# Altium schematic sheet Audio_testboard.SchDoc (part 1 of 2)
size A0; SheetNumber: 1; SheetTotal: 2
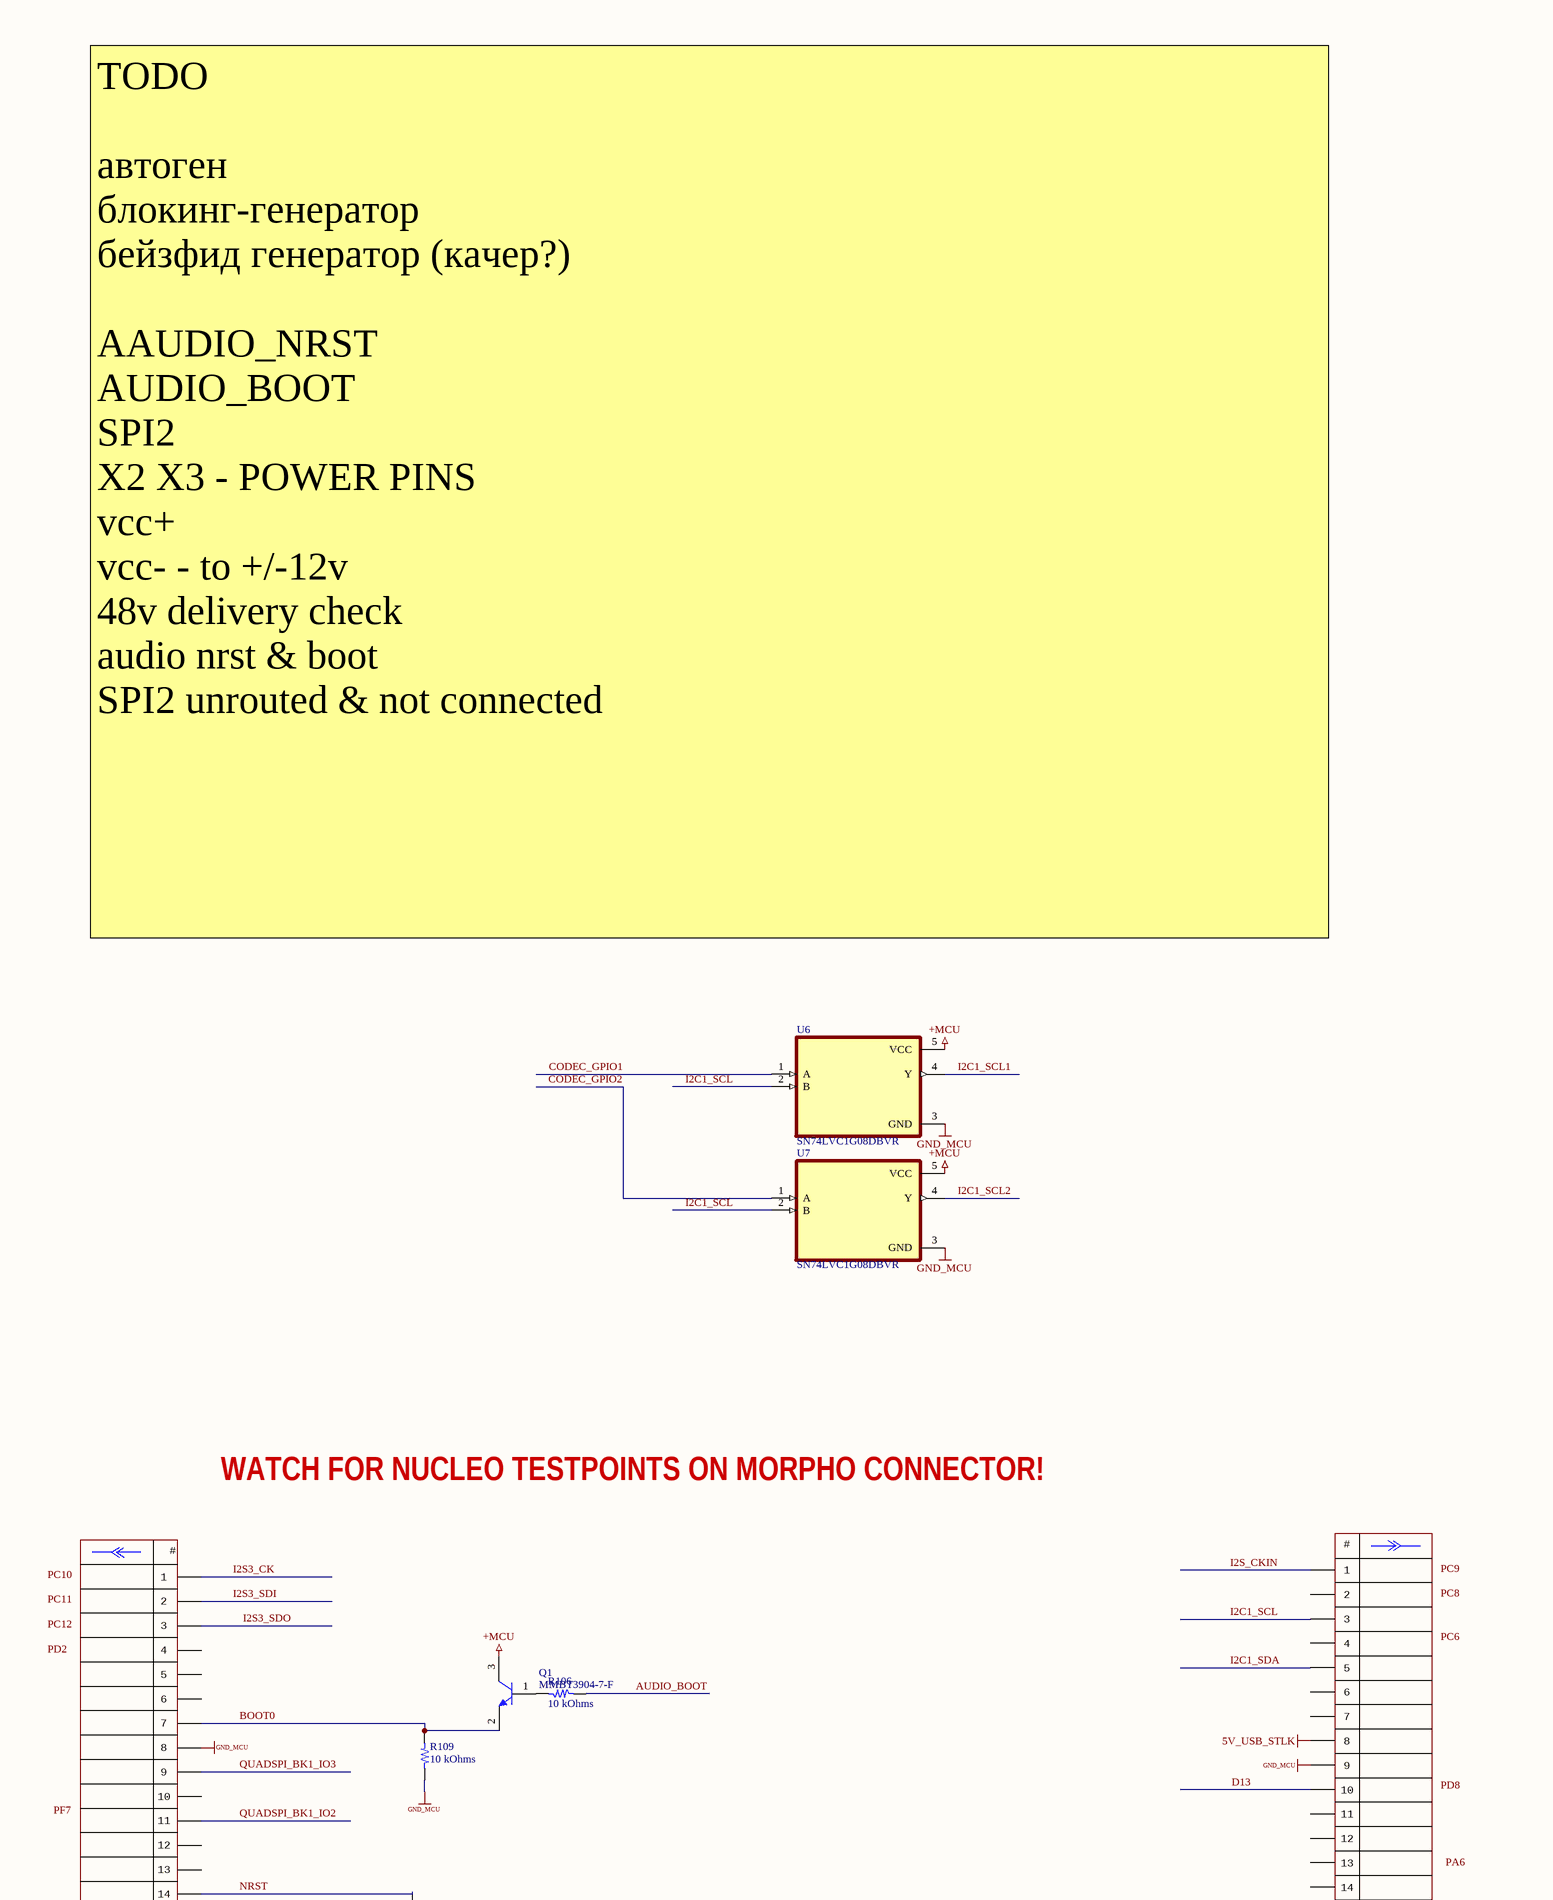
[diagram p0: Audio_testboard.SchDoc, top left]
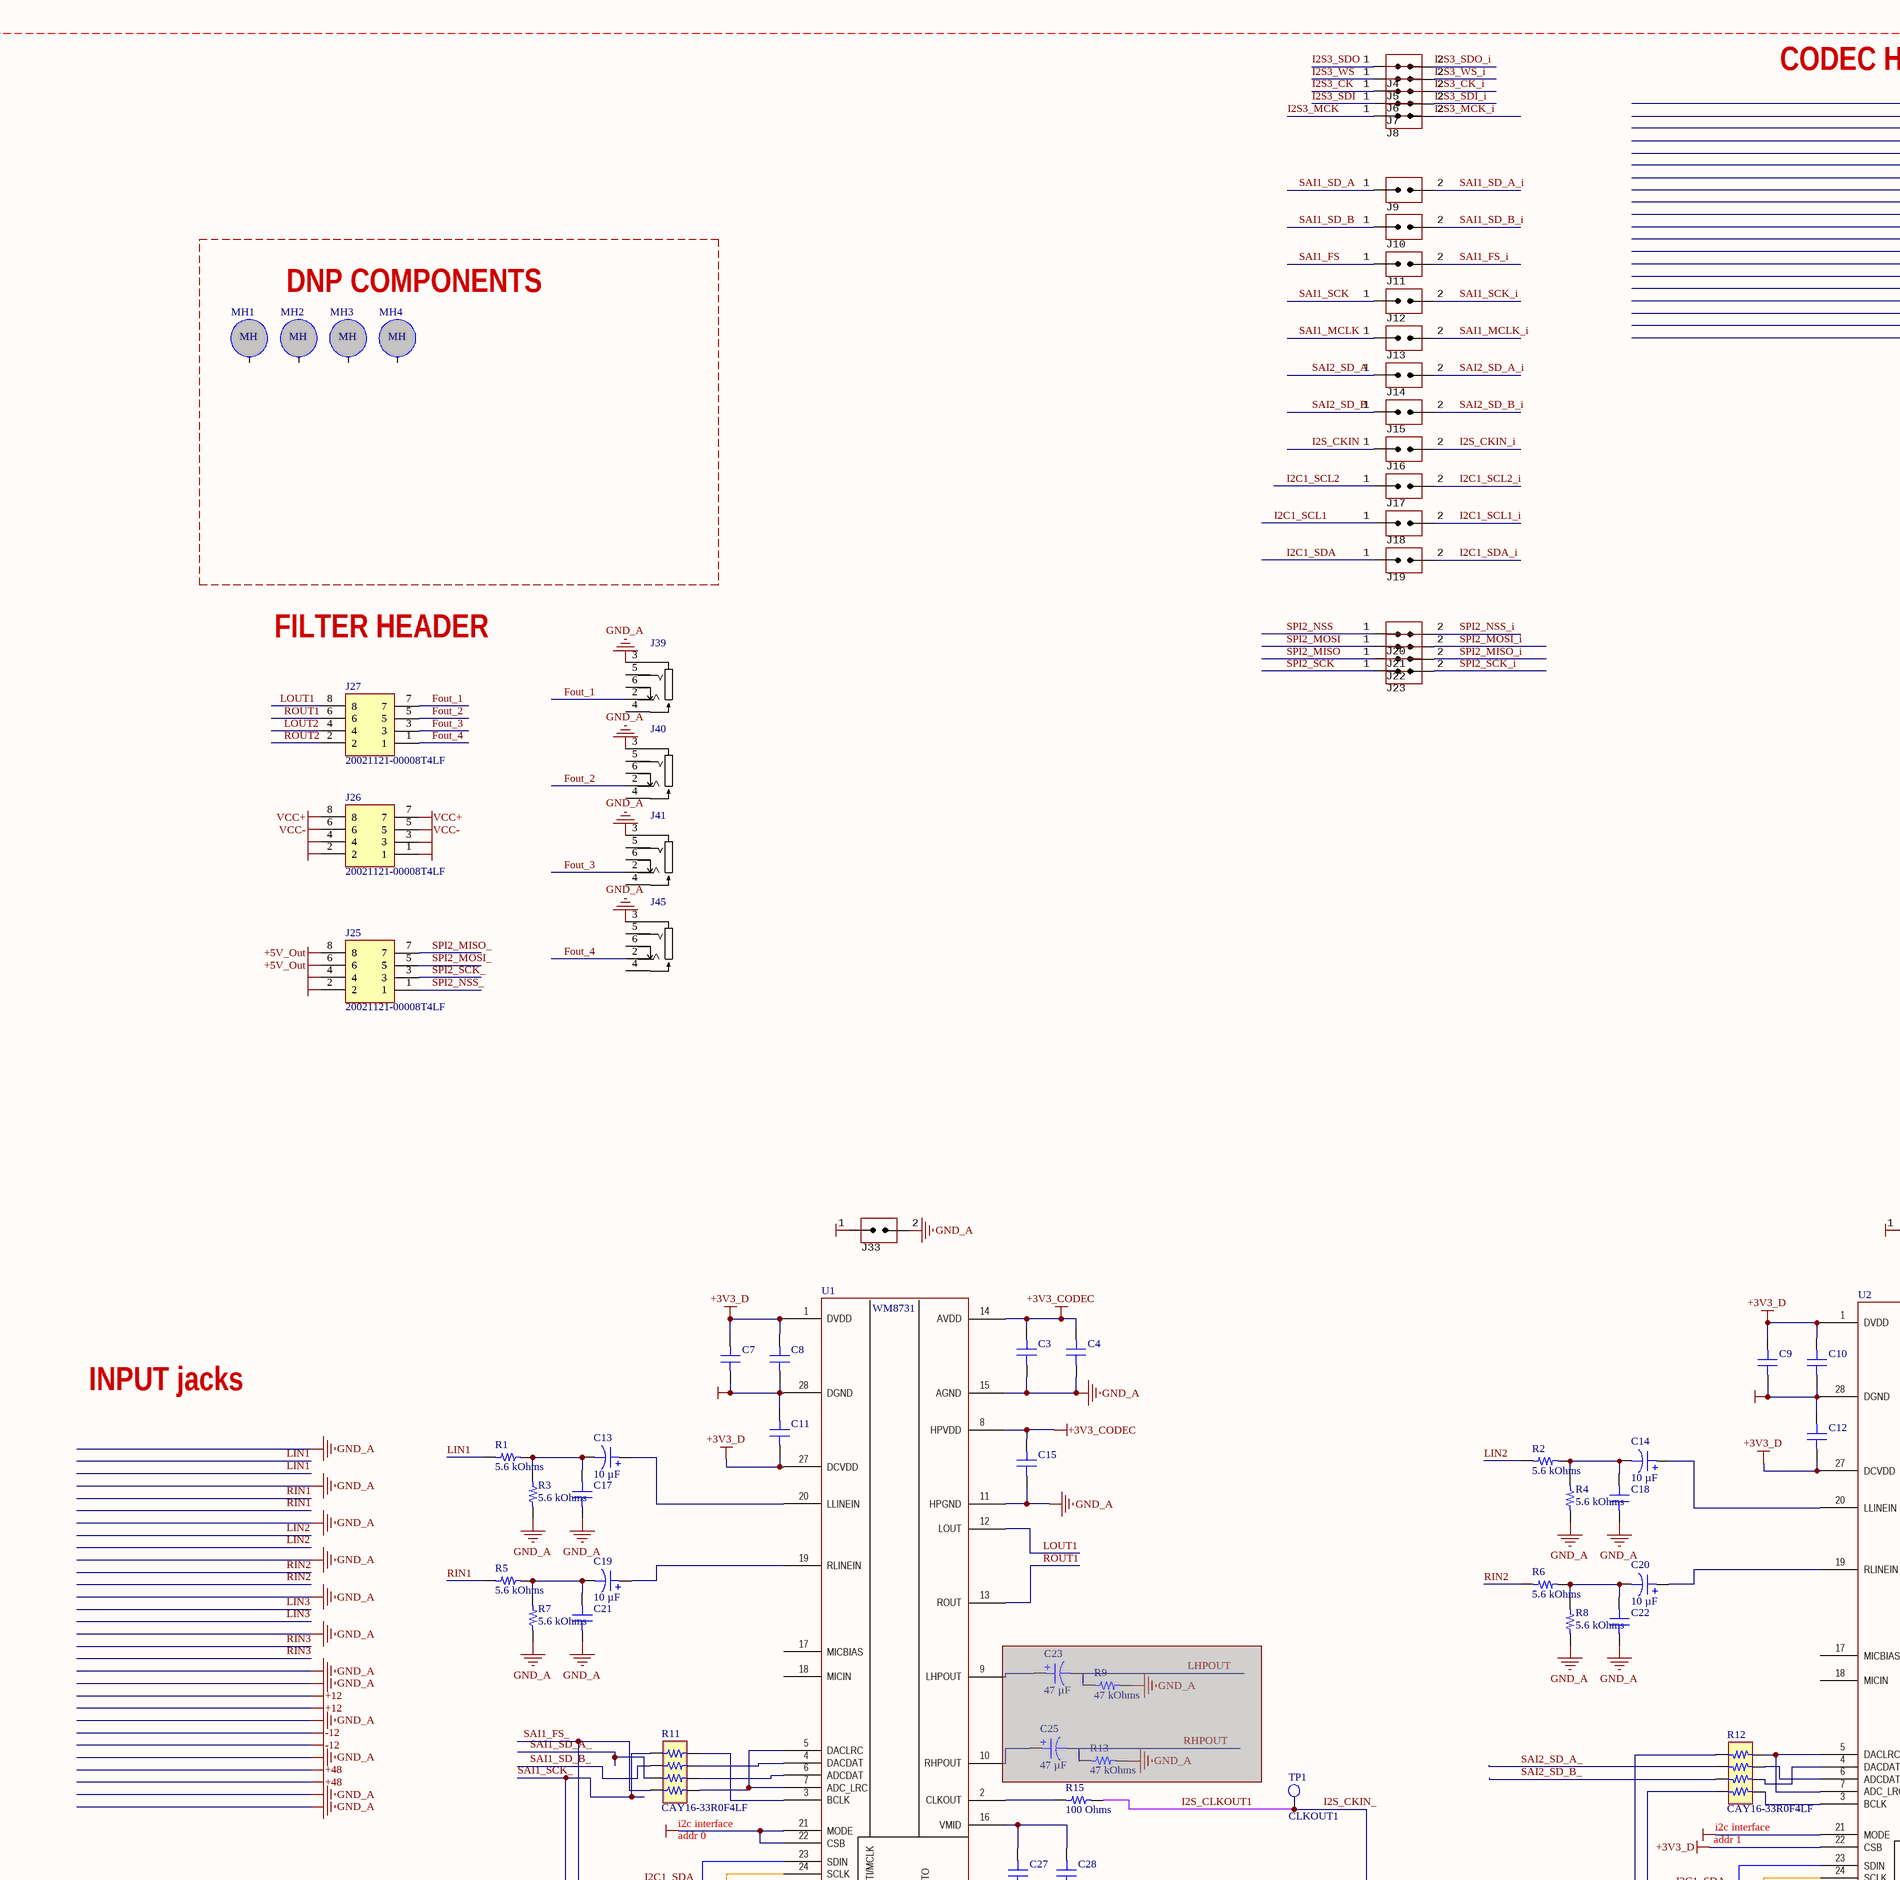
[diagram p1: Audio_testboard.SchDoc, top middle]
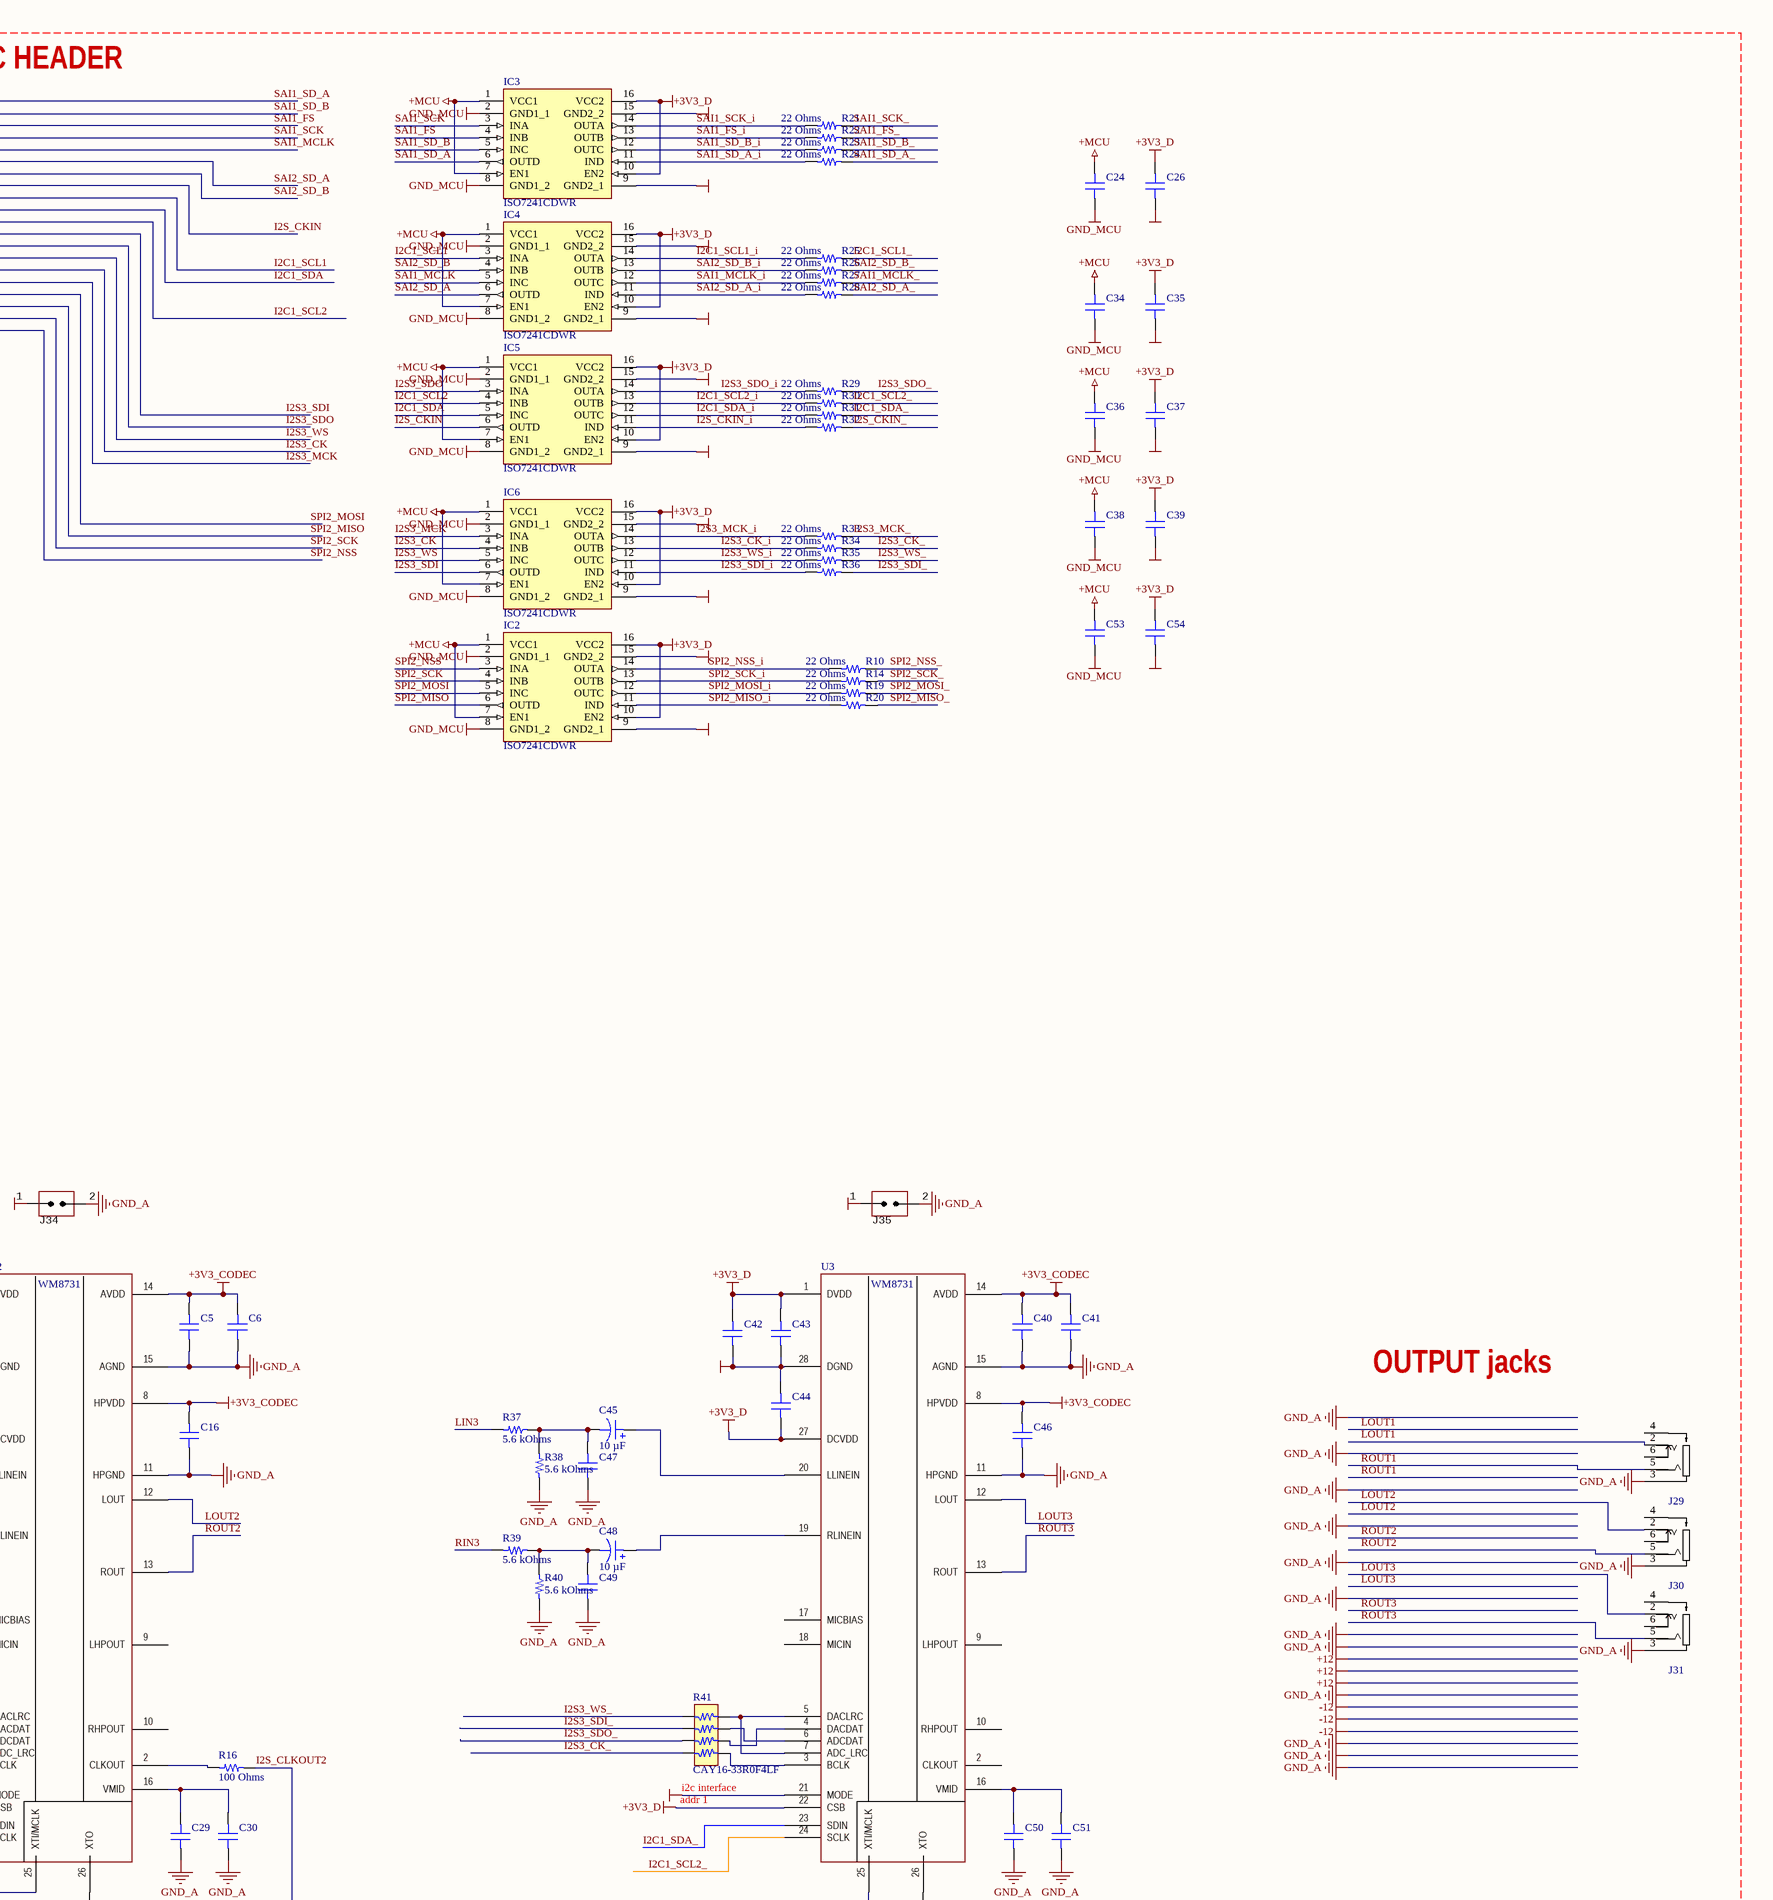
[diagram p2: Audio_testboard.SchDoc, top right]
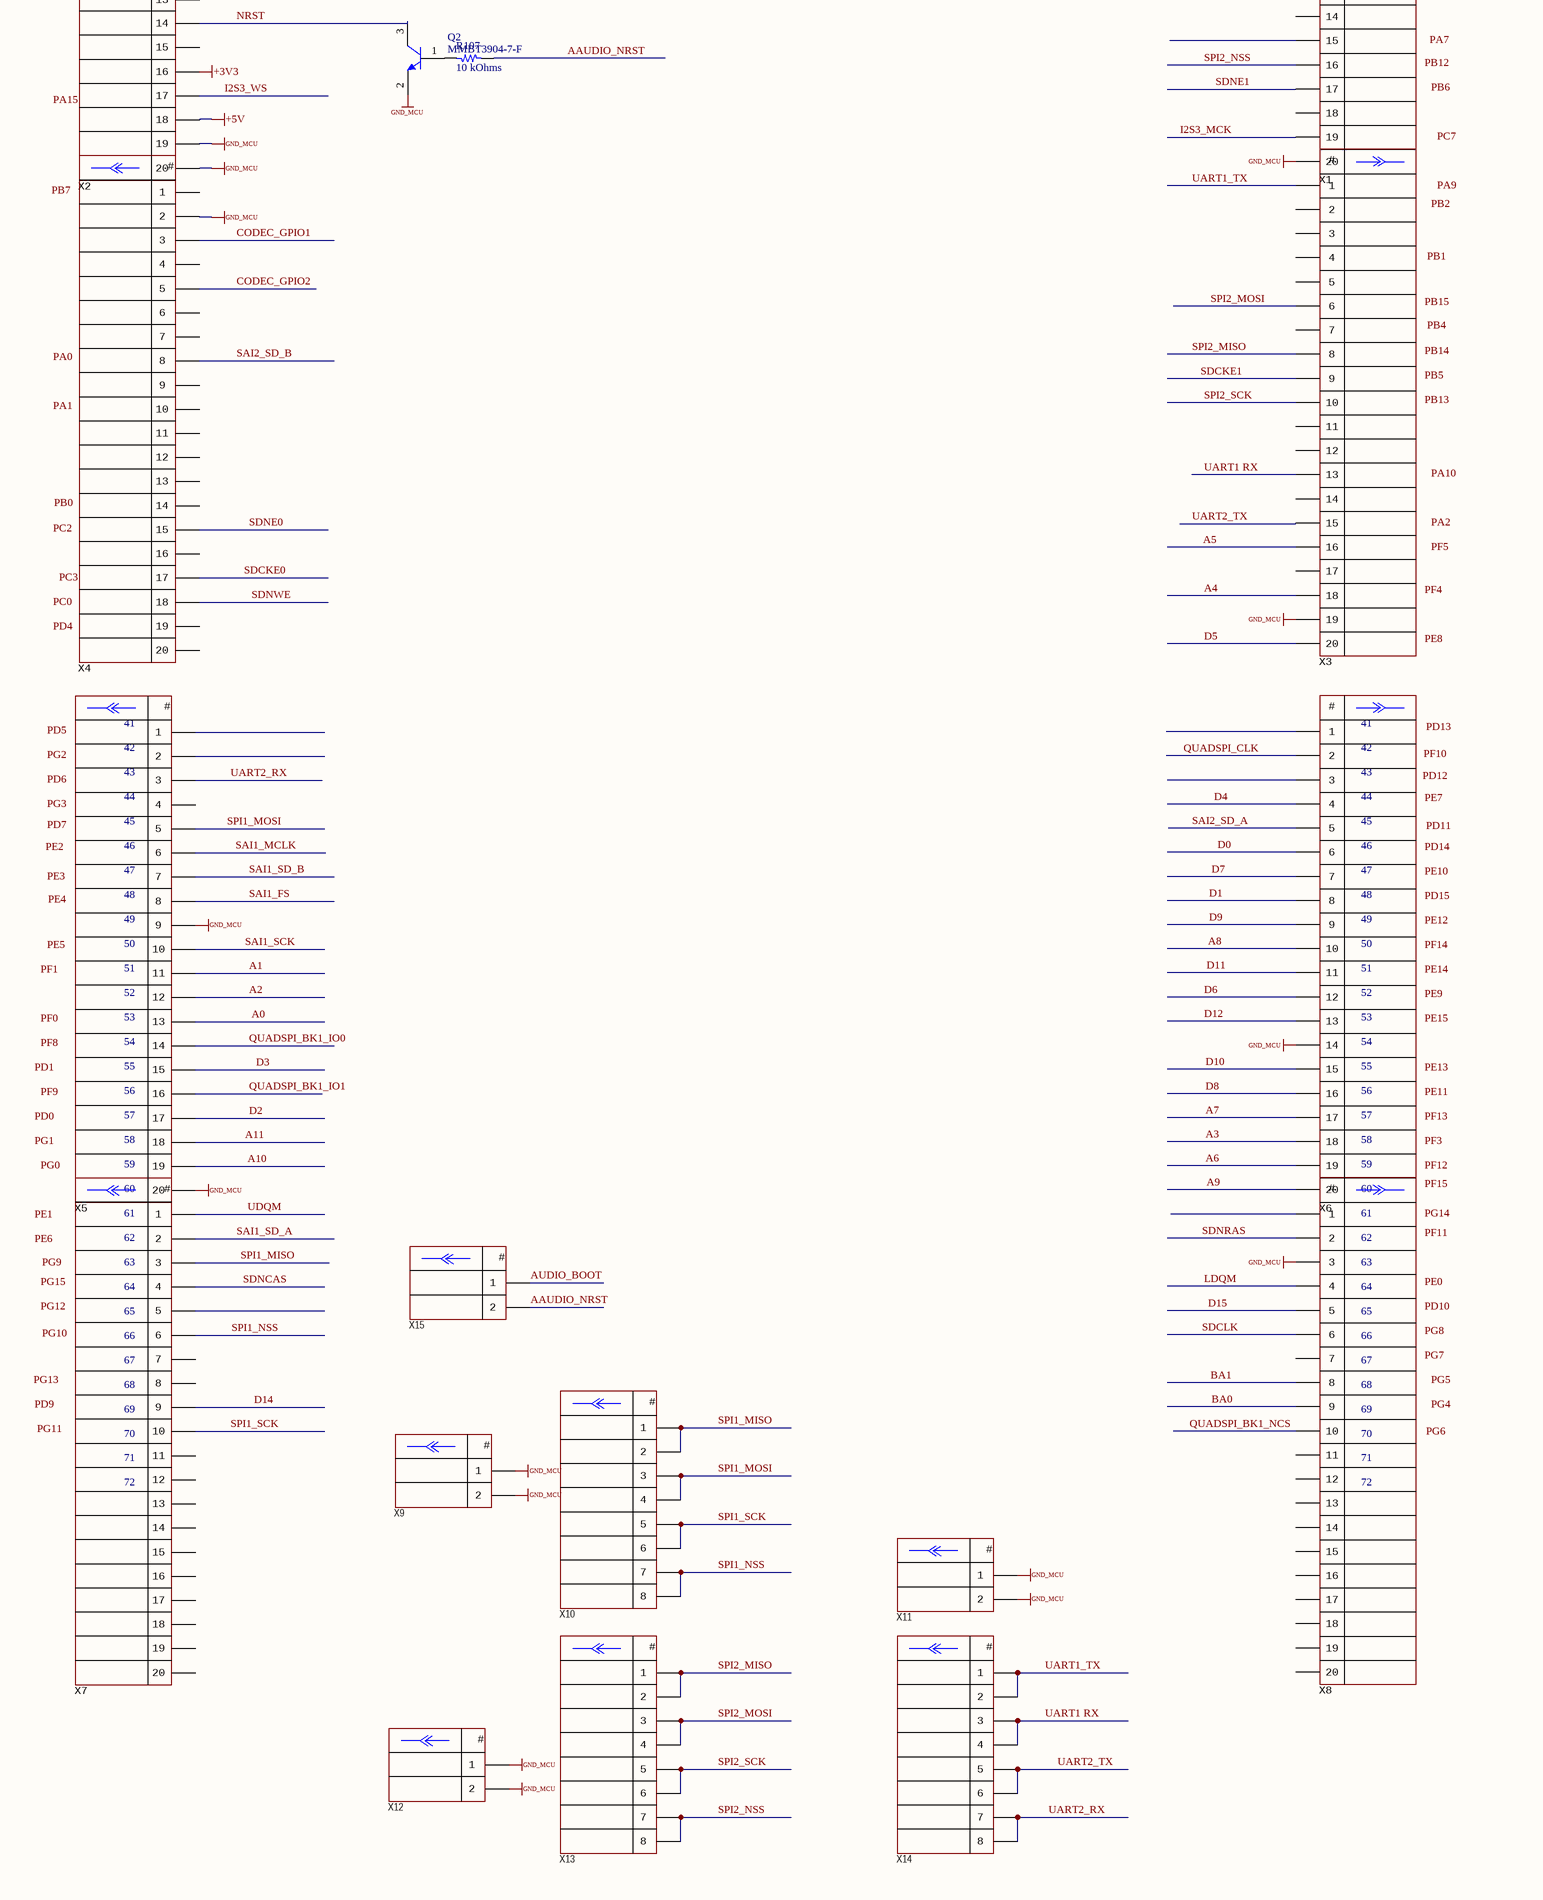
[diagram p3: Audio_testboard.SchDoc, bottom left]
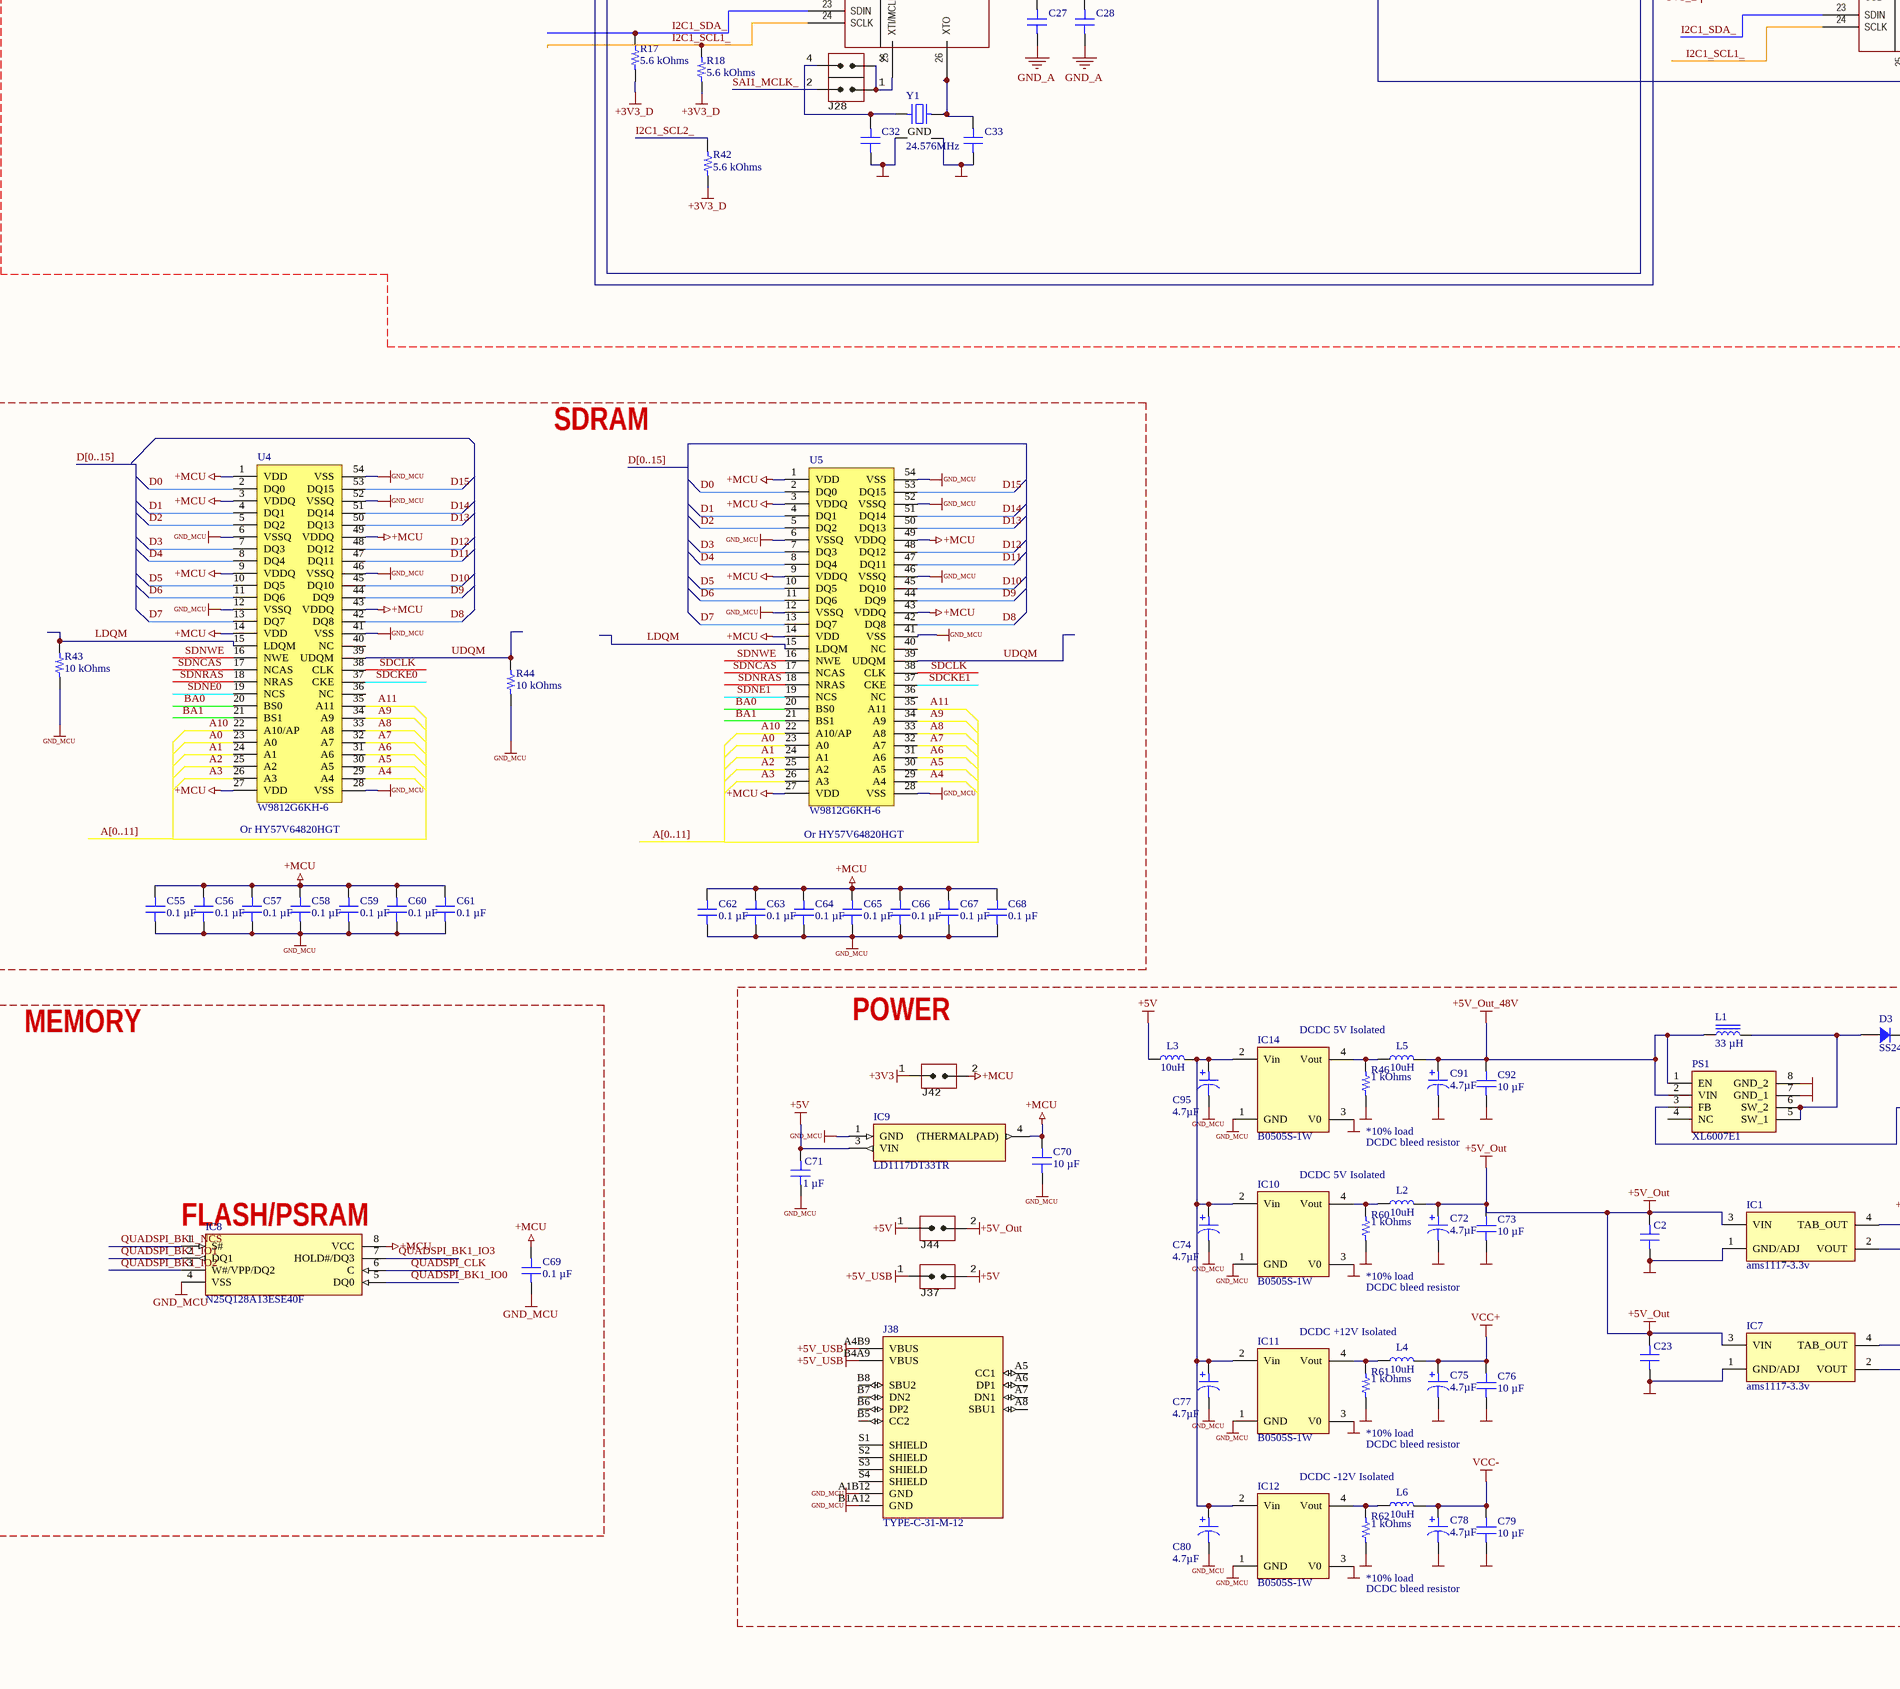
[diagram p4: Audio_testboard.SchDoc, bottom middle]
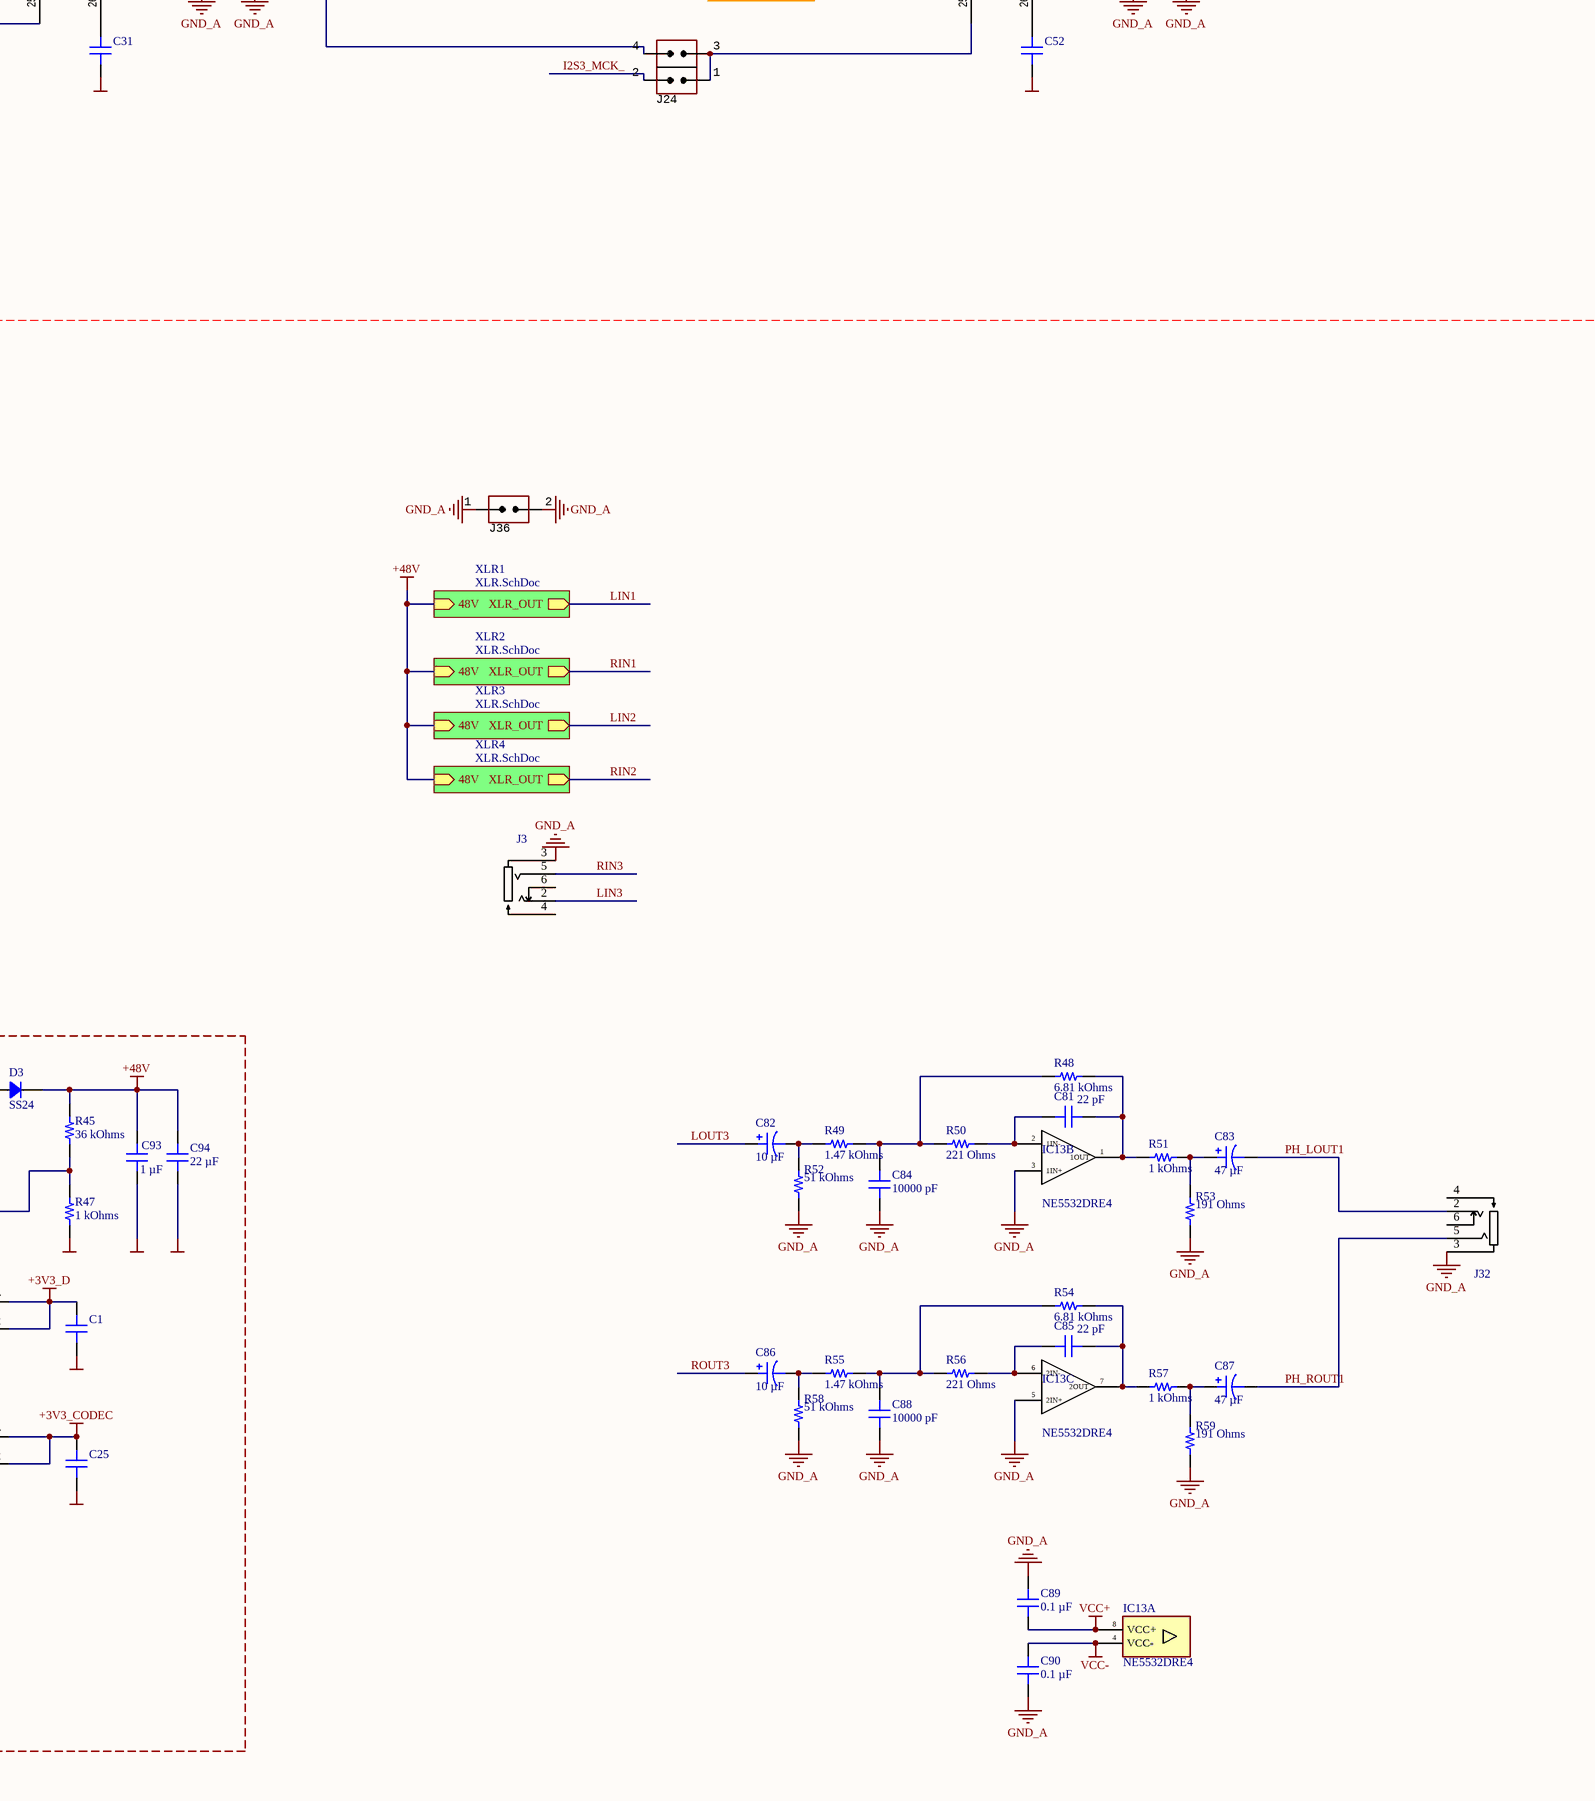
[diagram p5: Audio_testboard.SchDoc, bottom right]

## Parts
(Parts that share a designator on the sheet are numbered #1, #2 ... from top to bottom, then left to right.)
C1  10 µF  [CAP 0805_2012]  (value not drawn)
C2  1 µF  [CAP 0805_2012]  (value not drawn)
C3  0.1 µF  [CAP 0402_1005]  (value not drawn)
C4  10 µF  [CAP 0805_2012]  (value not drawn)
C5  0.1 µF  [CAP 0402_1005]  (value not drawn)
C6  10 µF  [CAP 0805_2012]  (value not drawn)
C7  10 µF  [CAP 0805_2012]  (value not drawn)
C8  0.1 µF  [CAP 0402_1005]  (value not drawn)
C9  10 µF  [CAP 0805_2012]  (value not drawn)
C10  0.1 µF  [CAP 0402_1005]  (value not drawn)
C11  0.1 µF  [CAP 0402_1005]  (value not drawn)
C12  0.1 µF  [CAP 0402_1005]  (value not drawn)
C13  10 µF  [CAP POL 1206_3216]
C14  10 µF  [CAP POL 1206_3216]
C15  0.1 µF  [CAP 0402_1005]  (value not drawn)
C16  0.1 µF  [CAP 0402_1005]  (value not drawn)
C17  220 pF  [CAP 0603_1608]  (value not drawn)
C18  220 pF  [CAP 0603_1608]  (value not drawn)
C19  10 µF  [CAP POL 1206_3216]
C20  10 µF  [CAP POL 1206_3216]
C21  220 pF  [CAP 0603_1608]  (value not drawn)
C22  220 pF  [CAP 0603_1608]  (value not drawn)
C23#1  47 µF  [CAP POL 2917_7343]  (masked out: inside a compile mask, not in the netlist)
C23#2  1 µF  [CAP 0805_2012]  (value not drawn)
C24  0.1µF  [CAP 0603_1608]  (value not drawn)
C25#1  47 µF  [CAP POL 2917_7343]  (masked out: inside a compile mask, not in the netlist)
C25#2  10 µF  [CAP 0805_2012]  (value not drawn)
C26  0.1µF  [CAP 0603_1608]  (value not drawn)
C27  0.1 µF  [CAP 0402_1005]  (value not drawn)
C28  10 µF  [CAP 0805_2012]  (value not drawn)
C29  0.1 µF  [CAP 0402_1005]  (value not drawn)
C30  10 µF  [CAP 0805_2012]  (value not drawn)
C31  9 pF  [CAP 0805_2012]  (value not drawn)
C32  9 pF  [CAP 0805_2012]  (value not drawn)
C33  9 pF  [CAP 0805_2012]  (value not drawn)
C34  0.1µF  [CAP 0603_1608]  (value not drawn)
C35  0.1µF  [CAP 0603_1608]  (value not drawn)
C36  0.1µF  [CAP 0603_1608]  (value not drawn)
C37  0.1µF  [CAP 0603_1608]  (value not drawn)
C38  0.1µF  [CAP 0603_1608]  (value not drawn)
C39  0.1µF  [CAP 0603_1608]  (value not drawn)
C40  0.1 µF  [CAP 0402_1005]  (value not drawn)
C41  10 µF  [CAP 0805_2012]  (value not drawn)
C42  10 µF  [CAP 0805_2012]  (value not drawn)
C43  0.1 µF  [CAP 0402_1005]  (value not drawn)
C44  0.1 µF  [CAP 0402_1005]  (value not drawn)
C45  10 µF  [CAP POL 1206_3216]
C46  0.1 µF  [CAP 0402_1005]  (value not drawn)
C47  220 pF  [CAP 0603_1608]  (value not drawn)
C48  10 µF  [CAP POL 1206_3216]
C49  220 pF  [CAP 0603_1608]  (value not drawn)
C50  0.1 µF  [CAP 0402_1005]  (value not drawn)
C51  10 µF  [CAP 0805_2012]  (value not drawn)
C52  9 pF  [CAP 0805_2012]  (value not drawn)
C53  0.1µF  [CAP 0603_1608]  (value not drawn)
C54  0.1µF  [CAP 0603_1608]  (value not drawn)
C55  0.1 µF  [CAP 0402_1005]
C56  0.1 µF  [CAP 0402_1005]
C57  0.1 µF  [CAP 0402_1005]
C58  0.1 µF  [CAP 0402_1005]
C59  0.1 µF  [CAP 0402_1005]
C60  0.1 µF  [CAP 0402_1005]
C61  0.1 µF  [CAP 0402_1005]
C62  0.1 µF  [CAP 0402_1005]
C63  0.1 µF  [CAP 0402_1005]
C64  0.1 µF  [CAP 0402_1005]
C65  0.1 µF  [CAP 0402_1005]
C66  0.1 µF  [CAP 0402_1005]
C67  0.1 µF  [CAP 0402_1005]
C68  0.1 µF  [CAP 0402_1005]
C69  0.1 µF  [CAP 0603_1608]
C70  10 µF  [CAP 0805_2012]
C71  1 µF  [CAP 0805_2012]
C72  4.7µF  [CAP POL 1411_3528]
C73  10 µF  [CAP 0805_2012]
C74  4.7µF  [CAP POL 1411_3528]
C75  4.7µF  [CAP POL 1411_3528]
C76  10 µF  [CAP 0805_2012]
C77  4.7µF  [CAP POL 1411_3528]
C78  4.7µF  [CAP POL 1411_3528]
C79  10 µF  [CAP 0805_2012]
C80  4.7µF  [CAP POL 1411_3528]
C81  22 pF  [CAP 0603_1608]
C82  10 µF  [CAP POL 1206_3216]
C83  47 µF  [CAP POL 2917_7343]
C84  10000 pF  [CAP 0603_1608]
C85  22 pF  [CAP 0603_1608]
C86  10 µF  [CAP POL 1206_3216]
C87  47 µF  [CAP POL 2917_7343]
C88  10000 pF  [CAP 0603_1608]
C89  0.1 µF  [CAP 0603_1608]
C90  0.1 µF  [CAP 0603_1608]
C91  4.7µF  [CAP POL 1411_3528]
C92  10 µF  [CAP 0805_2012]
C93  1 µF  [CAP 0805_2012]
C94  22 µF  [CAP 0805_2012]
C95  4.7µF  [CAP POL 1411_3528]
D3  SS24  [DO214AA SMB]
IC1  ams1117-3.3v  [SOT-223]
IC2  ISO7241CDWR  [SOIC127P1030X265-16N]
IC3  ISO7241CDWR  [SOIC127P1030X265-16N]
IC4  ISO7241CDWR  [SOIC127P1030X265-16N]
IC5  ISO7241CDWR  [SOIC127P1030X265-16N]
IC6  ISO7241CDWR  [SOIC127P1030X265-16N]
IC7  ams1117-3.3v  [SOT-223]
IC8  N25Q128A13ESE40F  [SOIC127P790X216-8N]
IC9  LD1117DT33TR  [TO228P972X240-3N]
IC10  B0505S-1W  [B0505S-1W]
IC11  B0505S-1W  [B0505S-1W]
IC12  B0505S-1W  [B0505S-1W]
IC13  NE5532DRE4  [SOIC127P600X175-8N]  (parts A,B,C of 3)
IC14  B0505S-1W  [B0505S-1W]
J3  35RASMT2BHNTRX  [PJ_327]  (value not drawn)
J4  (no value)  [CON: JUMPER x1]
J5  (no value)  [CON: JUMPER x1]
J6  (no value)  [CON: JUMPER x1]
J7  (no value)  [CON: JUMPER x1]
J8  (no value)  [CON: JUMPER x1]
J9  (no value)  [CON: JUMPER x1]
J10  (no value)  [CON: JUMPER x1]
J11  (no value)  [CON: JUMPER x1]
J12  (no value)  [CON: JUMPER x1]
J13  (no value)  [CON: JUMPER x1]
J14  (no value)  [CON: JUMPER x1]
J15  (no value)  [CON: JUMPER x1]
J16  (no value)  [CON: JUMPER x1]
J17  (no value)  [CON: JUMPER x1]
J18  (no value)  [CON: JUMPER x1]
J19  (no value)  [CON: JUMPER x1]
J20  (no value)  [CON: JUMPER x1]
J21  (no value)  [CON: JUMPER x1]
J22  (no value)  [CON: JUMPER x1]
J23  (no value)  [CON: JUMPER x1]
J24  (no value)  [CON: JUMPER x2]
J25  20021121-00008T4LF  [2002112100008T4LF]
J26  20021121-00008T4LF  [2002112100008T4LF]
J27  20021121-00008T4LF  [2002112100008T4LF]
J28  (no value)  [CON: JUMPER x2]
J29  35RASMT2BHNTRX  [PJ_327]  (value not drawn)
J30  35RASMT2BHNTRX  [PJ_327]  (value not drawn)
J31  35RASMT2BHNTRX  [PJ_327]  (value not drawn)
J32  35RASMT2BHNTRX  [PJ_327]  (value not drawn)
J33  (no value)  [CON: JUMPER x1]
J34  (no value)  [CON: JUMPER x1]
J35  (no value)  [CON: JUMPER x1]
J36  (no value)  [CON: JUMPER x1]
J37  (no value)  [CON: JUMPER x1]
J38  TYPE-C-31-M-12  [HRO_TYPE-C-31-M-12 - REZONIT]
J39  35RASMT2BHNTRX  [PJ_327]  (value not drawn)
J40  35RASMT2BHNTRX  [PJ_327]  (value not drawn)
J41  35RASMT2BHNTRX  [PJ_327]  (value not drawn)
J42  (no value)  [CON: JUMPER x1]
J44  (no value)  [CON: JUMPER x1]
J45  35RASMT2BHNTRX  [PJ_327]  (value not drawn)
L1  33 µH  [BOURNS SRR1280]
L2  10uH  [IND_CD54]
L3  10uH  [IND_CD54]
L4  10uH  [IND_CD54]
L5  10uH  [IND_CD54]
L6  10uH  [IND_CD54]
MH1  MountingHole  [Hole_2.5mm]  (value not drawn)
MH2  MountingHole  [Hole_2.5mm]  (value not drawn)
MH3  MountingHole  [Hole_2.5mm]  (value not drawn)
MH4  MountingHole  [Hole_2.5mm]  (value not drawn)
PS1  XL6007E1  [SOIC127P600X175-8N]
Q1  MMBT3904-7-F  [DIODES SOT-23-3]
Q2  MMBT3904-7-F  [DIODES SOT-23-3]
R1  5.6 kOhms  [RES 0603_1608]
R2  5.6 kOhms  [RES 0603_1608]
R3  5.6 kOhms  [RES 0603_1608]
R4  5.6 kOhms  [RES 0603_1608]
R5  5.6 kOhms  [RES 0603_1608]
R6  5.6 kOhms  [RES 0603_1608]
R7  5.6 kOhms  [RES 0603_1608]
R8  5.6 kOhms  [RES 0603_1608]
R9  47 kOhms  [RES 0603_1608]  (masked out: inside a compile mask, not in the netlist)
R10  22 Ohms  [RES 0402_1005]
R11  CAY16-33R0F4LF  [RESNET 1206-8 CONVEX]
R12  CAY16-33R0F4LF  [RESNET 1206-8 CONVEX]
R13  47 kOhms  [RES 0603_1608]  (masked out: inside a compile mask, not in the netlist)
R14  22 Ohms  [RES 0402_1005]
R15  100 Ohms  [RES 0402_1005]
R16  100 Ohms  [RES 0402_1005]
R17  5.6 kOhms  [RES 0603_1608]
R18  5.6 kOhms  [RES 0603_1608]
R19  22 Ohms  [RES 0402_1005]
R20  22 Ohms  [RES 0402_1005]
R21  22 Ohms  [RES 0402_1005]
R22  22 Ohms  [RES 0402_1005]
R23  22 Ohms  [RES 0402_1005]
R24  22 Ohms  [RES 0402_1005]
R25  22 Ohms  [RES 0402_1005]
R26  22 Ohms  [RES 0402_1005]
R27  22 Ohms  [RES 0402_1005]
R28  22 Ohms  [RES 0402_1005]
R29  22 Ohms  [RES 0402_1005]
R30  22 Ohms  [RES 0402_1005]
R31  22 Ohms  [RES 0402_1005]
R32  22 Ohms  [RES 0402_1005]
R33  22 Ohms  [RES 0402_1005]
R34  22 Ohms  [RES 0402_1005]
R35  22 Ohms  [RES 0402_1005]
R36  22 Ohms  [RES 0402_1005]
R37  5.6 kOhms  [RES 0603_1608]
R38  5.6 kOhms  [RES 0603_1608]
R39  5.6 kOhms  [RES 0603_1608]
R40  5.6 kOhms  [RES 0603_1608]
R41  CAY16-33R0F4LF  [RESNET 1206-8 CONVEX]
R42  5.6 kOhms  [RES 0603_1608]
R43  10 kOhms  [RES 0603_1608]
R44  10 kOhms  [RES 0603_1608]
R45  36 kOhms  [RES 0603_1608]
R46  1 kOhms  [RES 0603_1608]
R47  1 kOhms  [RES 0603_1608]
R48  6.81 kOhms  [RES 0603_1608]
R49  1.47 kOhms  [RES 0603_1608]
R50  221 Ohms  [RES 0603_1608]
R51  1 kOhms  [RES 0603_1608]
R52  51 kOhms  [RES 0603_1608]
R53  191 Ohms  [RES 0603_1608]
R54  6.81 kOhms  [RES 0603_1608]
R55  1.47 kOhms  [RES 0603_1608]
R56  221 Ohms  [RES 0603_1608]
R57  1 kOhms  [RES 0603_1608]
R58  51 kOhms  [RES 0603_1608]
R59  191 Ohms  [RES 0603_1608]
R60  1 kOhms  [RES 0603_1608]
R61  1 kOhms  [RES 0603_1608]
R62  1 kOhms  [RES 0603_1608]
R106  10 kOhms  [RES 0603_1608]
R107  10 kOhms  [RES 0603_1608]
R109  10 kOhms  [RES 0603_1608]
TP1  CLKOUT1  [TESTPOINT]  (no BOM)
U1  WM8731  [TSSOP-28]
U2  WM8731  [TSSOP-28]
U3  WM8731  [TSSOP-28]
U4  W9812G6KH-6  [TSOP-54]
U5  W9812G6KH-6  [TSOP-54]
U6  SN74LVC1G08DBVR  [SOT95P280X145-5N]
U7  SN74LVC1G08DBVR  [SOT95P280X145-5N]
X1  (no value)  [CON: PBD-20]
X2  (no value)  [CON: PBD-20]
X3  (no value)  [CON: PBD-20]
X4  (no value)  [CON: PBD-20]
X5  (no value)  [CON: PBD-20]
X6  (no value)  [CON: PBD-20]
X7  (no value)  [CON: PBD-20]
X8  (no value)  [CON: PBD-20]
X9  (no value)  [CON: PLS-2]
X10  (no value)  [CON: PLD-8]
X11  (no value)  [CON: PLS-2]
X12  (no value)  [CON: PLS-2]
X13  (no value)  [CON: PLD-8]
X14  (no value)  [CON: PLD-8]
X15  (no value)  [CON: PLS-2]
Y1  24.576MHz  [ABRACON ABM8G]

## Blocks framed on the sheet
DNP COMPONENTS: MH1-MH4
SDRAM: C55-C68 R43 R44 U4 U5
POWER: C1 C2 C23#2 C25#2 C70-C80 C91-C95 D3 IC1 IC7 IC9-IC12 IC14 J37 J38 J42 J44 L1-L6 PS1 R45-R47 R60-R62

## Sub-sheets
XLR1 = XLR.SchDoc: XLR_OUT (out), 48V (in)
XLR2 = XLR.SchDoc: XLR_OUT (out), 48V (in)
XLR3 = XLR.SchDoc: XLR_OUT (out), 48V (in)
XLR4 = XLR.SchDoc: XLR_OUT (out), 48V (in)

## Nets
5V_USB_STLK: X1.8
+3V3: J42.1(IN) X2.16
+3V3_CODEC: C3.2 C4.2 C5.2 C6.2 C15.2 C16.2 C25#2.2 C40.2 C41.2 C46.2 IC7.2(VOUT) IC7.4(TAB_OUT) U1.8(HPVDD) U1.14(AVDD) U2.8(HPVDD) U2.14(AVDD) U3.8(HPVDD) U3.14(AVDD)
+3V3_D: C1.2 C7.2 C8.2 C9.2 C10.2 C11.1 C12.1 C26.2 C35.2 C37.2 C39.2 C42.2 C43.2 C44.1 C54.2 IC1.2(VOUT) IC1.4(TAB_OUT) IC2.10(EN2) IC2.16(VCC2) IC3.10(EN2) IC3.16(VCC2) IC4.10(EN2) IC4.16(VCC2) IC5.10(EN2) IC5.16(VCC2) IC6.10(EN2) IC6.16(VCC2) R17.1 R18.1 R42.1 U1.1(DVDD) U1.27(DCVDD) U2.1(DVDD) U2.22(CSB) U2.27(DCVDD) U3.1(DVDD) U3.22(CSB) U3.27(DCVDD)
+5V: C71.2 IC9.3(VIN) J37.2(IN) J44.1(IN) L3.2 X2.18
+5V_Out: C2.2 C23#2.2 C72.1 C73.2 IC1.3(VIN) IC7.3(VIN) J25.6 J25.8 J44.2(IN) L2.1
+5V_Out_48V: C91.1 C92.2 L1.1 L5.1 PS1.1(EN) PS1.2(VIN)
+5V_USB: J37.1(IN) J38.A4B9(VBUS) J38.B4A9(VBUS)
+48V: C93.2 C94.2 D3.2 R45.2 ; sheet XLR1/48V, sheet XLR2/48V, sheet XLR3/48V, sheet XLR4/48V
+MCU: C24.2 C34.2 C36.2 C38.2 C53.2 C55.1 C56.1 C57.1 C58.1 C59.1 C60.1 C61.1 C62.1 C63.1 C64.1 C65.1 C66.1 C67.1 C68.1 C69.2 C70.2 IC2.1(VCC1) IC2.7(EN1) IC3.1(VCC1) IC3.7(EN1) IC4.1(VCC1) IC4.7(EN1) IC5.1(VCC1) IC5.7(EN1) IC6.1(VCC1) IC6.7(EN1) IC8.8(VCC) IC9.4((THERMALPAD)) J42.2(IN) Q1.3(C) U4.1(VDD) U4.3(VDDQ) U4.9(VDDQ) U4.14(VDD) U4.27(VDD) U4.43(VDDQ) U4.49(VDDQ) U5.1(VDD) U5.3(VDDQ) U5.9(VDDQ) U5.14(VDD) U5.27(VDD) U5.43(VDDQ) U5.49(VDDQ) U6.5(VCC) U7.5(VCC)
GND: C1.1 C2.1 C7.1 C8.1 C9.1 C10.1 C11.2 C12.2 C23#2.1 C25#2.1 C26.1 C31.2 C32.2 C33.2 C35.1 C37.1 C39.1 C42.1 C43.1 C44.2 C52.2 C54.1 C72.2 C73.1 C75.2 C76.1 C78.2 C79.1 C91.2 C92.1 C93.1 C94.1 IC1.1(GND/ADJ) IC2.9(GND2_1) IC2.15(GND2_2) IC3.9(GND2_1) IC3.15(GND2_2) IC4.9(GND2_1) IC4.15(GND2_2) IC5.9(GND2_1) IC5.15(GND2_2) IC6.9(GND2_1) IC6.15(GND2_2) IC7.1(GND/ADJ) IC10.3(V0) IC11.3(V0) IC12.3(V0) IC14.3(V0) J25.2 J25.4 J26.1 J26.2 J26.3 J26.4 J33.1(IN) J34.1(IN) J35.1(IN) PS1.7(GND_1) PS1.8(GND_2) R46.1 R47.1 R60.1 R61.1 R62.1 U1.21(MODE) U1.22(CSB) U1.28(DGND) U2.21(MODE) U2.28(DGND) U3.21(MODE) U3.28(DGND) Y1.2(GND) Y1.4(GND)
GND_A: C3.1 C4.1 C5.1 C6.1 C15.1 C16.1 C17.1 C18.1 C21.1 C22.1 C27.2 C28.2 C29.2 C30.2 C40.1 C41.1 C46.1 C47.1 C49.1 C50.2 C51.2 C84.1 C88.1 C89.2 C90.1 IC13.3(1IN+) IC13.5(2IN+) J3.3 J29.3 J30.3 J31.3 J32.3 J33.2(IN) J34.2(IN) J35.2(IN) J36.1(IN) J36.2(IN) J39.3 J40.3 J41.3 J45.3 R3.1 R4.1 R7.1 R8.1 R38.1 R40.1 R52.2 R53.1 R58.2 R59.1 U1.11(HPGND) U1.15(AGND) U2.11(HPGND) U2.15(AGND) U3.11(HPGND) U3.15(AGND)
GND_MCU: C24.1 C34.1 C36.1 C38.1 C53.1 C55.2 C56.2 C57.2 C58.2 C59.2 C60.2 C61.2 C62.2 C63.2 C64.2 C65.2 C66.2 C67.2 C68.2 C69.1 C70.1 C71.1 C74.2 C77.2 C80.2 C95.2 IC2.2(GND1_1) IC2.8(GND1_2) IC3.2(GND1_1) IC3.8(GND1_2) IC4.2(GND1_1) IC4.8(GND1_2) IC5.2(GND1_1) IC5.8(GND1_2) IC6.2(GND1_1) IC6.8(GND1_2) IC8.4(VSS) IC9.1(GND) IC10.1(GND) IC11.1(GND) IC12.1(GND) IC14.1(GND) J38.A1B12(GND) J38.B1A12(GND) Q2.2(E) R43.1 R44.1 R109.2 U4.6(VSSQ) U4.12(VSSQ) U4.28(VSS) U4.41(VSS) U4.46(VSSQ) U4.52(VSSQ) U4.54(VSS) U5.6(VSSQ) U5.12(VSSQ) U5.28(VSS) U5.41(VSS) U5.46(VSSQ) U5.52(VSSQ) U5.54(VSS) U6.3(GND) U7.3(GND) X1.9 X1.20 X2.8 X2.19 X2.20 X3.19 X4.2 X5.9 X5.20 X6.14 X8.3 X9.1 X9.2 X11.1 X11.2 X12.1 X12.2
VCC+: C75.1 C76.2 C89.1 IC13.8(VCC+) J26.7 J26.8 L4.1
VCC-: C78.1 C79.2 C90.2 IC13.4(VCC-) J26.5 J26.6 L6.1
A0: U4.23(A0) U5.23(A0) X5.13
A1: U4.24(A1) U5.24(A1) X5.11
A2: U4.25(A2) U5.25(A2) X5.12
A3: U4.26(A3) U5.26(A3) X6.18
A4: U4.29(A4) U5.29(A4) X3.18
A5: U4.30(A5) U5.30(A5) X3.16
A6: U4.31(A6) U5.31(A6) X6.19
A7: U4.32(A7) U5.32(A7) X6.17
A8: U4.33(A8) U5.33(A8) X6.10
A9: U4.34(A9) U5.34(A9) X6.20
A10: U4.22(A10/AP) U5.22(A10/AP) X5.19
A11: U4.35(A11) U5.35(A11) X5.18
AAUDIO_NRST: R107.1 X15.2
AUDIO_BOOT: R106.1 X15.1
BA0: U4.20(BS0) U5.20(BS0) X8.9
BA1: U4.21(BS1) U5.21(BS1) X8.8
BOOT0: Q1.2(E) R109.1 X2.7
CODEC_GPIO1: U6.1(A) X4.3
CODEC_GPIO2: U7.1(A) X4.5
D0: U4.2(DQ0) U5.2(DQ0) X6.6
D1: U4.4(DQ1) U5.4(DQ1) X6.8
D2: U4.5(DQ2) U5.5(DQ2) X5.17
D3: U4.7(DQ3) U5.7(DQ3) X5.15
D4: U4.8(DQ4) U5.8(DQ4) X6.4
D5: U4.10(DQ5) U5.10(DQ5) X3.20
D6: U4.11(DQ6) U5.11(DQ6) X6.12
D7: U4.13(DQ7) U5.13(DQ7) X6.7
D8: U4.42(DQ8) U5.42(DQ8) X6.16
D9: U4.44(DQ9) U5.44(DQ9) X6.9
D10: U4.45(DQ10) U5.45(DQ10) X6.15
D11: U4.47(DQ11) U5.47(DQ11) X6.11
D12: U4.48(DQ12) U5.48(DQ12) X6.13
D13: U4.50(DQ13) U5.50(DQ13) X1.10
D14: U4.51(DQ14) U5.51(DQ14) X7.9
D15: U4.53(DQ15) U5.53(DQ15) X8.5
Fout_1: J27.7 J39.2
Fout_2: J27.5 J40.2
Fout_3: J27.3 J41.2
Fout_4: J27.1 J45.2
I2C1_SCL: U6.2(B) U7.2(B) X1.3
I2C1_SCL1: IC4.3(INA) J18.1(IN) U6.4(Y)
I2C1_SCL1_: R18.2 R25.2 U1.24(SCLK) U2.24(SCLK)
I2C1_SCL1_i: IC4.14(OUTA) J18.2(IN) R25.1
I2C1_SCL2: IC5.4(INB) J17.1(IN) U7.4(Y)
I2C1_SCL2_: R30.2 R42.2 U3.24(SCLK)
I2C1_SCL2_i: IC5.13(OUTB) J17.2(IN) R30.1
I2C1_SDA: IC5.5(INC) J19.1(IN) X1.5
I2C1_SDA_: R17.2 R31.2 U1.23(SDIN) U2.23(SDIN) U3.23(SDIN)
I2C1_SDA_i: IC5.12(OUTC) J19.2(IN) R31.1
I2S3_CK: IC6.4(INB) J6.1(IN) X2.1
I2S3_CK_: R34.2 R41.5
I2S3_CK_i: IC6.13(OUTB) J6.2(IN) R34.1
I2S3_MCK: IC6.3(INA) J8.1(IN) X1.19
I2S3_MCK_: J24.2(IN) R33.2
I2S3_MCK_i: IC6.14(OUTA) J8.2(IN) R33.1
I2S3_SDI: IC6.6(OUTD) J7.1(IN) X2.2
I2S3_SDI_: R36.2 R41.7
I2S3_SDI_i: IC6.11(IND) J7.2(IN) R36.1
I2S3_SDO: IC5.3(INA) J4.1(IN) X2.3
I2S3_SDO_: R29.2 R41.6
I2S3_SDO_i: IC5.14(OUTA) J4.2(IN) R29.1
I2S3_WS: IC6.5(INC) J5.1(IN) X2.17
I2S3_WS_: R35.2 R41.8
I2S3_WS_i: IC6.12(OUTC) J5.2(IN) R35.1
I2S_CKIN: IC5.6(OUTD) J16.1(IN) X1.1
I2S_CKIN_: R15.2 R32.2 TP1.1 U2.25(XTI/MCLK)  [also labelled I2S_CLKOUT1]
I2S_CKIN_i: IC5.11(IND) J16.2(IN) R32.1
I2S_CLKOUT2: J24.4(IN) R16.2
LDQM: R43.2 U4.15(LDQM) U5.15(LDQM) X8.4
LIN1: R1.1 ; sheet XLR1/XLR_OUT
LIN2: R2.1 ; sheet XLR3/XLR_OUT
LIN3: J3.2 R37.1
LOUT1: J27.8 J29.2 U1.12(LOUT)
LOUT2: J27.4 J30.2 U2.12(LOUT)
LOUT3: C82.1 J31.2 U3.12(LOUT)
NRST: Q2.3(C) X2.14
PH_LOUT1: C83.2 J32.2
PH_ROUT1: C87.2 J32.5
QUADSPI_BK1_IO0: IC8.5(DQ0) X5.14
QUADSPI_BK1_IO1: IC8.2(DQ1) X5.16
QUADSPI_BK1_IO2: IC8.3(W#/VPP/DQ2) X2.11
QUADSPI_BK1_IO3: IC8.7(HOLD#/DQ3) X2.9
QUADSPI_BK1_NCS: IC8.1(S#) X8.10
QUADSPI_CLK: IC8.6(C) X6.2
RIN1: R5.1 ; sheet XLR2/XLR_OUT
RIN2: R6.1 ; sheet XLR4/XLR_OUT
RIN3: J3.5 R39.1
ROUT1: J27.6 J29.5 U1.13(ROUT)
ROUT2: J27.2 J30.5 U2.13(ROUT)
ROUT3: C86.1 J31.5 U3.13(ROUT)
SAI1_FS: IC3.4(INB) J11.1(IN) X5.8
SAI1_FS_: R11.4 R12.8 R22.2
SAI1_FS_i: IC3.13(OUTB) J11.2(IN) R22.1
SAI1_MCLK: IC4.5(INC) J13.1(IN) X5.6
SAI1_MCLK_: J28.2(IN) R27.2
SAI1_MCLK_i: IC4.12(OUTC) J13.2(IN) R27.1
SAI1_SCK: IC3.3(INA) J12.1(IN) X5.10
SAI1_SCK_: R11.1 R12.5 R21.2
SAI1_SCK_i: IC3.14(OUTA) J12.2(IN) R21.1
SAI1_SD_A: IC3.6(OUTD) J9.1(IN) X7.2
SAI1_SD_A_: R11.3 R24.2
SAI1_SD_A_i: IC3.11(IND) J9.2(IN) R24.1
SAI1_SD_B: IC3.5(INC) J10.1(IN) X5.7
SAI1_SD_B_: R11.2 R23.2
SAI1_SD_B_i: IC3.12(OUTC) J10.2(IN) R23.1
SAI2_SD_A: IC4.6(OUTD) J14.1(IN) X6.5
SAI2_SD_A_: R12.7 R28.2
SAI2_SD_A_i: IC4.11(IND) J14.2(IN) R28.1
SAI2_SD_B: IC4.4(INB) J15.1(IN) X4.8
SAI2_SD_B_: R12.6 R26.2
SAI2_SD_B_i: IC4.13(OUTB) J15.2(IN) R26.1
SDCKE0: U4.37(CKE) X4.17
SDCKE1: U5.37(CKE) X3.9
SDCLK: U4.38(CLK) U5.38(CLK) X8.6
SDNCAS: U4.17(NCAS) U5.17(NCAS) X7.4
SDNE0: U4.19(NCS) X4.15
SDNE1: U5.19(NCS) X1.17
SDNRAS: U4.18(NRAS) U5.18(NRAS) X8.2
SDNWE: U4.16(NWE) U5.16(NWE) X4.18
SPI1_MISO: X7.3 X10.1 X10.2
SPI1_MOSI: X5.5 X10.3 X10.4
SPI1_NSS: X7.6 X10.7 X10.8
SPI1_SCK: X7.10 X10.5 X10.6
SPI2_MISO: IC2.6(OUTD) J22.1(IN) X3.8 X13.1 X13.2
SPI2_MISO_: J25.7 R20.2
SPI2_MISO_i: IC2.11(IND) J22.2(IN) R20.1
SPI2_MOSI: IC2.5(INC) J21.1(IN) X3.6 X13.3 X13.4
SPI2_MOSI_: J25.5 R19.2
SPI2_MOSI_i: IC2.12(OUTC) J21.2(IN) R19.1
SPI2_NSS: IC2.3(INA) J20.1(IN) X1.16 X13.7 X13.8
SPI2_NSS_: J25.1 R10.2
SPI2_NSS_i: IC2.14(OUTA) J20.2(IN) R10.1
SPI2_SCK: IC2.4(INB) J23.1(IN) X3.10 X13.5 X13.6
SPI2_SCK_: J25.3 R14.2
SPI2_SCK_i: IC2.13(OUTB) J23.2(IN) R14.1
UART1 RX: X3.13 X14.3 X14.4
UART1_TX: X3.1 X14.1 X14.2
UART2_RX: X5.3 X14.7 X14.8
UART2_TX: X3.15 X14.5 X14.6
UDQM: R44.2 U4.39(UDQM) U5.39(UDQM) X7.1
NetC13_1: C13.1 U1.20(LLINEIN)
NetC13_2: C13.2 C17.2 R1.2 R3.2
NetC14_1: C14.1 U2.20(LLINEIN)
NetC14_2: C14.2 C18.2 R2.2 R4.2
NetC19_1: C19.1 U1.19(RLINEIN)
NetC19_2: C19.2 C21.2 R5.2 R7.2
NetC20_1: C20.1 U2.19(RLINEIN)
NetC20_2: C20.2 C22.2 R6.2 R8.2
NetC27_1: C27.1 C28.1 U1.16(VMID)
NetC29_1: C29.1 C30.1 U2.16(VMID)
NetC31_1: C31.1 U2.26(XTO)
NetC32_1: C32.1 J28.4(IN) Y1.1
NetC33_1: C33.1 U1.26(XTO) Y1.3
NetC45_1: C45.1 U3.20(LLINEIN)
NetC45_2: C45.2 C47.2 R37.2 R38.2
NetC48_1: C48.1 U3.19(RLINEIN)
NetC48_2: C48.2 C49.2 R39.2 R40.2
NetC50_1: C50.1 C51.1 U3.16(VMID)
NetC52_1: C52.1 U3.26(XTO)
NetC74_1: C74.1 C77.1 C80.1 C95.1 IC10.2(Vin) IC11.2(Vin) IC12.2(Vin) IC14.2(Vin) L3.1
NetC81_1: C81.1 IC13.1(1OUT) R48.2 R51.1
NetC81_2: C81.2 IC13.2(1IN-) R50.2
NetC82_2: C82.2 R49.1 R52.1
NetC83_1: C83.1 R51.2 R53.2
NetC84_2: C84.2 R48.1 R49.2 R50.1
NetC85_1: C85.1 IC13.7(2OUT) R54.2 R57.1
NetC85_2: C85.2 IC13.6(2IN-) R56.2
NetC86_2: C86.2 R55.1 R58.1
NetC87_1: C87.1 R57.2 R59.2
NetC88_2: C88.2 R54.1 R55.2 R56.1
NetD3_1: D3.1 L1.2 PS1.5(SW_1) PS1.6(SW_2)
NetIC10_4: IC10.4(Vout) L2.2 R60.2
NetIC11_4: IC11.4(Vout) L4.2 R61.2
NetIC12_4: IC12.4(Vout) L6.2 R62.2
NetIC14_4: IC14.4(Vout) L5.2 R46.2
NetJ24_1: J24.1(IN) J24.3(IN) U3.25(XTI/MCLK)
NetJ28_1: J28.1(IN) J28.3(IN) U1.25(XTI/MCLK)
NetPS1_3: PS1.3(FB) R45.1 R47.2
NetQ1_1: Q1.1(B) R106.2
NetQ2_1: Q2.1(B) R107.2
NetR11_5: R11.5 U1.5(DACLRC) U1.7(ADC_LRC)
NetR11_6: R11.6 U1.6(ADCDAT)
NetR11_7: R11.7 U1.4(DACDAT)
NetR11_8: R11.8 U1.3(BCLK)
NetR12_1: R12.1 U2.5(DACLRC) U2.7(ADC_LRC)
NetR12_2: R12.2 U2.6(ADCDAT)
NetR12_3: R12.3 U2.4(DACDAT)
NetR12_4: R12.4 U2.3(BCLK)
NetR15_1: R15.1 U1.2(CLKOUT)
NetR16_1: R16.1 U2.2(CLKOUT)
NetR41_1: R41.1 U3.5(DACLRC) U3.7(ADC_LRC)
NetR41_2: R41.2 U3.6(ADCDAT)
NetR41_3: R41.3 U3.4(DACDAT)
NetR41_4: R41.4 U3.3(BCLK)

Not connected (* = marked no-connect by the designer): J3 4(5) 6(4); J29 4(5) 6(4); J30 4(5) 6(4); J31 4(5) 6(4); J32 4(5) 6(4); J38 A5(CC1) A6(DP1) A7(DN1) A8(SBU1) B5(CC2) B6(DP2) B7(DN2) B8(SBU2) S1(SHIELD) S2(SHIELD) S3(SHIELD) S4(SHIELD); J39 4(5) 5(3) 6(4); J40 4(5) 5(3) 6(4); J41 4(5) 5(3) 6(4); J45 4(5) 5(3) 6(4); MH1 0; MH2 0; MH3 0; MH4 0; PS1 4(NC); U1 9(LHPOUT) 10(RHPOUT) 17(MICBIAS) 18(MICIN); U2 9(LHPOUT) 10(RHPOUT) 17(MICBIAS) 18(MICIN); U3 2(CLKOUT) 9(LHPOUT) 10(RHPOUT) 17(MICBIAS) 18(MICIN); U4 36(NC) 40(NC); U5 36(NC) 40(NC); X1 2 4 6 7 11 12 13 14 15 18; X2 4 5 6 10 12 13 15; X3 2 3 4 5 7 11 12 14 17; X4 1 4 6 7 9 10 11 12 13 14 16 19 20; X5 1 2 4; X6 1 3; X7 5 7 8 11 12 13 14 15 16 17 18 19 20; X8 1 7 11 12 13 14 15 16 17 18 19 20

## Buses and harness runs
bus A[0..11]
bus D[0..15]

## Layout directives
mark named Codec: +3V3_CODEC, +3V3_D, +5V_Out, +12, +48, +MCU, -12, Fout_1, Fout_2, Fout_3, Fout_4, GND, GND_A, GND_MCU, I2C1_SCL1, I2C1_SCL1_, I2C1_SCL1_i, I2C1_SCL2, I2C1_SCL2_, I2C1_SCL2_i, I2C1_SDA, I2C1_SDA_, I2C1_SDA_i, I2S3_CK, I2S3_CK_, I2S3_CK_i, I2S3_MCK, I2S3_MCK_, I2S3_MCK_i, I2S3_SDI, I2S3_SDI_, I2S3_SDI_i, I2S3_SDO, I2S3_SDO_, I2S3_SDO_i, I2S3_WS, I2S3_WS_, I2S3_WS_i, I2S_CKIN, I2S_CKIN_, I2S_CKIN_i, I2S_CLKOUT1, I2S_CLKOUT2, LHPOUT, LIN1, LIN2, LIN3, LOUT1, LOUT2, LOUT3, RHPOUT, RIN1, RIN2, RIN3, ROUT1, ROUT2, ROUT3, SAI1_FS, SAI1_FS_, SAI1_FS_i, SAI1_MCLK, SAI1_MCLK_, SAI1_MCLK_i, SAI1_SCK, SAI1_SCK_, SAI1_SCK_i, SAI1_SD_A, SAI1_SD_A_, SAI1_SD_A_i, SAI1_SD_B, SAI1_SD_B_, SAI1_SD_B_i, SAI2_SD_A, SAI2_SD_A_, SAI2_SD_A_i, SAI2_SD_B, SAI2_SD_B_, SAI2_SD_B_i, SPI2_MISO, SPI2_MISO_, SPI2_MISO_i, SPI2_MOSI, SPI2_MOSI_, SPI2_MOSI_i, SPI2_NSS, SPI2_NSS_, SPI2_NSS_i, SPI2_SCK, SPI2_SCK_, SPI2_SCK_i, VCC+, VCC-

## Notes on the sheet
- CODEC HEADER
- FILTER HEADER
- TODO
  автоген
  блокинг-генератор
  бейзфид генератор (качер?)
  AAUDIO_NRST
  AUDIO_BOOT
  SPI2
  X2 X3 - POWER PINS
  vcc+
  vcc- - to +/-12v
  48v delivery check
  audio nrst & boot
  SPI2 unrouted & not connected
- INPUT jacks
- OUTPUT jacks
- WATCH FOR NUCLEO TESTPOINTS ON MORPHO CONNECTOR!
- (near R11) i2c interface
- (near R12) i2c interface
- (near R41) i2c interface
- (near R11) addr 0
- (near R12) addr 1
- (near R41) addr 1
- (near X5) 41
- (near X5) 42
- (near X6) 41
- (near X6) 42
- (near X5) 43
- (near X5) 44
- (near X5) 45
- (near X6) 43
- (near X6) 44
- (near X6) 45
- (near X5) 46
- (near X5) 47
- (near X6) 46
- (near X6) 47
- (near U4) Or HY57V64820HGT
- (near U5) Or HY57V64820HGT
- (near X5) 48
- (near X5) 49
- (near X5) 50
- (near X6) 48
- (near X6) 49
- (near X6) 50
- (near X5) 51
- (near X5) 52
- (near X6) 51
- (near X6) 52
- (near X5) 53
- (near X5) 54
- (near X5) 55
- (near X6) 53
- (near X6) 54
- (near X6) 55
- MEMORY
- DCDC 5V Isolated
- (near X5) 56
- (near X5) 57
- (near X6) 56
- (near X6) 57
- (near X5) 58
- 59
- 60
- (near X6) 58
- DCDC bleed resistor
- *10% load
- 61
- 62
- (near IC8) FLASH/PSRAM
- (near X7) 63
- (near X7) 64
- (near X7) 65
- (near X8) 63
- (near X8) 64
- (near X8) 65
- (near X7) 66
- (near X7) 67
- (near X8) 66
- (near X8) 67
- DCDC +12V Isolated
- (near X7) 68
- (near X7) 69
- (near X7) 70
- (near X8) 68
- (near X8) 69
- (near X8) 70
- (near X7) 71
- (near X7) 72
- (near X8) 71
- (near X8) 72
- DCDC -12V Isolated
- Labels drawn without touching a wire or pin: PA0, PA1, PA2, PA6, PA7, PA9, PA10, PA15, PB0, PB1, PB2, PB4, PB5, PB6, PB7, PB12, PB13, PB14, PB15, PC0, PC2, PC3, PC6, PC7, PC8, PC9, PC10, PC11, PC12, PD0, PD1, PD2, PD4, PD5, PD6, PD7, PD8, PD9, PD10, PD11, PD12, PD13, PD14, PD15, PE0, PE1, PE2, PE3, PE4, PE5, PE6, PE7, PE8, PE9, PE10, PE11, PE12, PE13, PE14, PE15, PF0, PF1, PF3, PF4, PF5, PF7, PF8, PF9, PF10, PF11, PF12, PF13, PF14, PF15, PG0, PG1, PG2, PG3, PG4, PG5, PG6, PG7, PG8, PG9, PG10, PG11, PG12, PG13, PG14, PG15
- (in symbol MountingHole) MH
- (in symbol PBD-20) #
- (in symbol PLD-8) #
- (in symbol PLS-2) #